# EAGLE design TUR8535 com mae - V1.02 (EAGLE 5.01)
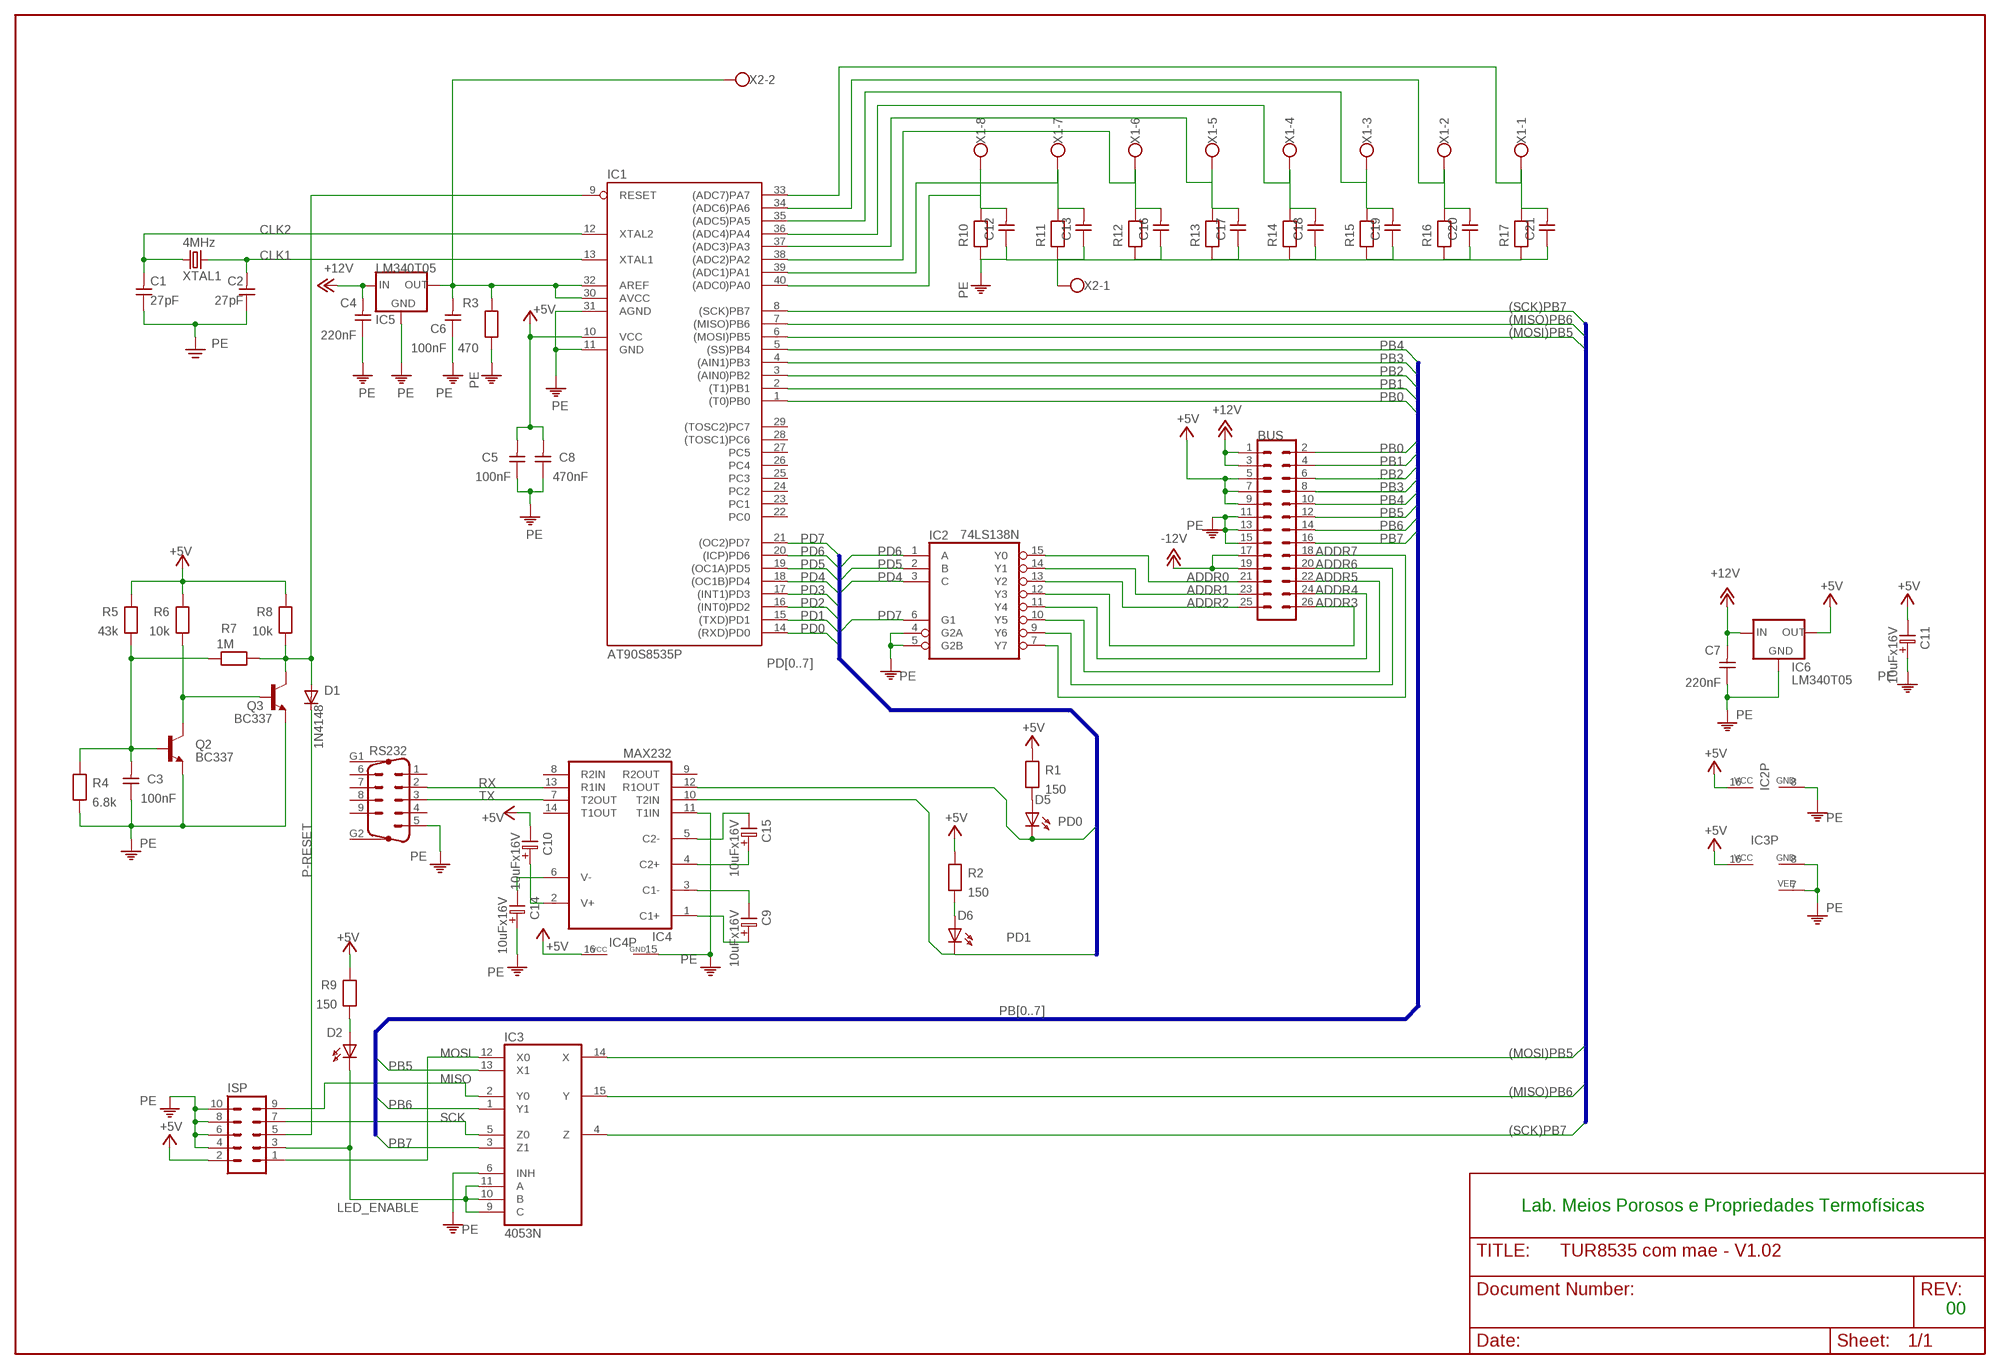
[diagram p0: schematic, sheet 1]

## Parts
BUS  ML26  [ML26]
C1  27pF  CAPNP-5  [C-5]
C2  27pF  CAPNP-5  [C-5]
C3  100nF  CAPNP-5  [C-5]
C4  220nF  CAPNP-5  [C-5]
C5  100nF  CAPNP-5  [C-5]
C6  100nF  CAPNP-5  [C-5]
C7  220nF  CAPNP-5  [C-5]
C8  470nF  CAPNP-5  [C-5]
C9  10uFx16V  ELC-2,5L  [ES-2,5L]
C10  10uFx16V  ELC-2,5L  [ES-2,5L]
C11  10uFx16V  ELC-2,5L  [ES-2,5L]
C12  CAPNP-5  [C-5]
C13  CAPNP-5  [C-5]
C14  10uFx16V  ELC-2,5L  [ES-2,5L]
C15  10uFx16V  ELC-2,5L  [ES-2,5L]
C16  CAPNP-5  [C-5]
C17  CAPNP-5  [C-5]
C18  CAPNP-5  [C-5]
C19  CAPNP-5  [C-5]
C20  CAPNP-5  [C-5]
C21  CAPNP-5  [C-5]
D1  1N4148  [DO35-10]
D2  LED5MM  [LED5MM]
D5  LED3MM  [LED3MM]
D6  LED3MM  [LED3MM]
IC1  AT90S8535P  [DIL40]
IC2  74LS138N  [DIL16]
IC3  4053N  [DIL16]
IC4  MAX232  [DIL16]
IC5  LM340T05  78XXL  [78XXL]
IC6  LM340T05  78XXL  [78XXL]
ISP  ML10  [ML10]
Q2  BC337  [TO92]
Q3  BC337  [TO92]
R1  150  RESEU-10  [R-10]
R2  150  RESEU-10  [R-10]
R3  470  RESEU-10  [R-10]
R4  6.8k  RESEU-10  [R-10]
R5  43k  RESEU-10  [R-10]
R6  10k  RESEU-10  [R-10]
R7  1M  RESEU-10  [R-10]
R8  10k  RESEU-10  [R-10]
R9  150  RESEU-10  [R-10]
R10  RESEU-10  [R-10]
R11  RESEU-10  [R-10]
R12  RESEU-10  [R-10]
R13  RESEU-10  [R-10]
R14  RESEU-10  [R-10]
R15  RESEU-10  [R-10]
R16  RESEU-10  [R-10]
R17  RESEU-10  [R-10]
RS232  M09HP  [M09HP]
X1  AK500/8  [AK500/8]
X2  AK500/2  [AK500/2]
XTAL1  4MHz  CRYTALHC18U-V  [HC18U-V]

## Nets
(MISO)PB6: IC1.7((MISO)PB6) IC3.15(Y)
(MOSI)PB5: IC1.6((MOSI)PB5) IC3.14(X)
(SCK)PB7: IC1.8((SCK)PB7) IC3.4(Z)
+5V: BUS.5 BUS.7 BUS.9 C5.2 C8.2 C10.2 C11.2 IC1.10(VCC) IC2.16(VCC) IC3.16(VCC) IC4.16(VCC) IC6.OUT ISP.2 R1.2 R2.2 R5.2 R6.2 R8.2 R9.2
+12V: BUS.1 BUS.3 C4.2 C7.2 IC5.IN IC6.IN
-12V: BUS.17 BUS.19
ADDR0: BUS.21 IC2.15(Y0)
ADDR1: BUS.23 IC2.14(Y1)
ADDR2: BUS.25 IC2.13(Y2)
ADDR3: BUS.26 IC2.12(Y3)
ADDR4: BUS.24 IC2.11(Y4)
ADDR5: BUS.22 IC2.10(Y5)
ADDR6: BUS.20 IC2.9(Y6)
ADDR7: BUS.18 IC2.7(Y7)
AREF: C6.2 IC1.30(AVCC) IC1.32(AREF) IC5.OUT R3.2 X2.2
CLK1: C2.2 IC1.13(XTAL1) XTAL1.2
CLK2: C1.2 IC1.12(XTAL2) XTAL1.1
LED_ENABLE: D2.K(C) IC3.9(C) IC3.10(B) IC3.11(A) ISP.3
MISO: IC3.2(Y0) ISP.9
MOSI: IC3.12(X0) ISP.1
N$2: C10.1 IC4.2(V+)
N$3: C14.2 IC4.6(V-)
N$7: Q2.3(C) Q3.2(B) R6.1
N$9: C3.2 Q2.2(B) R4.2 R5.1 R7.1
N$11: C15.2 IC4.5(C2-)
N$13: C15.1 IC4.4(C2+)
N$14: C9.2 IC4.3(C1-)
N$15: C9.1 IC4.1(C1+)
N$16: C12.2 IC1.40((ADC0)PA0) R10.2 X1.8
N$19: D2.A R9.1
N$20: D5.A R1.1
N$21: D6.A R2.1
N$22: C13.2 IC1.39((ADC1)PA1) R11.2 X1.7
N$23: C16.2 IC1.38((ADC2)PA2) R12.2 X1.6
N$24: C18.2 IC1.36((ADC4)PA4) R14.2 X1.4
N$25: C20.2 IC1.34((ADC6)PA6) R16.2 X1.2
N$26: C21.2 IC1.33((ADC7)PA7) R17.2 X1.1
N$29: C17.2 IC1.37((ADC3)PA3) R13.2 X1.5
N$31: C19.2 IC1.35((ADC5)PA5) R15.2 X1.3
P-RESET: D1.C ISP.5
PB0: BUS.2 IC1.1((T0)PB0)
PB1: BUS.4 IC1.2((T1)PB1)
PB2: BUS.6 IC1.3((AIN0)PB2)
PB3: BUS.8 IC1.4((AIN1)PB3)
PB4: BUS.10 IC1.5((SS)PB4)
PB5: BUS.12 IC3.13(X1)
PB6: BUS.14 IC3.1(Y1)
PB7: BUS.16 IC3.3(Z1)
PD0: D5.K(C) IC1.14((RXD)PD0) IC4.12(R1OUT)
PD1: D6.K(C) IC1.15((TXD)PD1) IC4.10(T2IN)
PD2: IC1.16((INT0)PD2)
PD3: IC1.17((INT1)PD3)
PD4: IC1.18((OC1B)PD4) IC2.3(C)
PD5: IC1.19((OC1A)PD5) IC2.2(B)
PD6: IC1.20((ICP)PD6) IC2.1(A)
PD7: IC1.21((OC2)PD7) IC2.6(G1)
PE: BUS.11 BUS.13 BUS.15 C1.1 C2.1 C3.1 C4.1 C5.1 C6.1 C7.1 C8.1 C11.1 C12.1 C13.1 C14.1 C16.1 C17.1 C18.1 C19.1 C20.1 C21.1 IC1.11(GND) IC1.31(AGND) IC2.4(G2A) IC2.5(G2B) IC2.8(GND) IC3.6(INH) IC3.7(VEE) IC3.8(GND) IC4.11(T1IN) IC4.15(GND) IC5.GND IC6.GND ISP.4 ISP.6 ISP.8 ISP.10 Q2.1(E) Q3.1(E) R3.1 R4.1 R10.1 R11.1 R12.1 R13.1 R14.1 R15.1 R16.1 R17.1 RS232.5 X2.1
RST: D1.A IC1.9(RESET) Q3.3(C) R7.2 R8.1
RX: IC4.13(R1IN) RS232.2
SCK: IC3.5(Z0) ISP.7
TX: IC4.7(T2OUT) RS232.3
Unconnected: IC1.22(PC0) IC1.23(PC1) IC1.24(PC2) IC1.25(PC3) IC1.26(PC4) IC1.27(PC5) IC1.28((TOSC1)PC6) IC1.29((TOSC2)PC7) IC4.8(R2IN) IC4.9(R2OUT) IC4.14(T1OUT) RS232.1 RS232.4 RS232.6 RS232.7 RS232.8 RS232.9 RS232.G1 RS232.G2

## Buses
PB[0..7]
(SCK)PB7,(MISO)PB6,(MOSI)PB5
PD[0..7]

## Notes on the sheet
- Lab. Meios Porosos e Propriedades Termofísicas
- 00

## Library data of the parts
BUS = con-harting-ml:ML26: HARTING
C1-C8 C12 C13 C16-C21 = discrete:CAPNP-5
C9-C11 C14 C15 = discrete:ELC-2,5L
D1 = diode:1N4148: DIODE high speed (Philips)
D2 D5 D6 = led:LED: LED
IC1 = atmel:AT90*8535P: MICROCONTROLLER 8 Kbytes FLASH 512 bytes SRAM 512 bytes EEPROM UART 8-channel 10 bit ADC
IC2 = 74xx-eu:74*138: 3-line to 8-line DECODER/DEMULTIPLEXER
IC3 = 40xx:4053: Triple 2-channel ANALOG MULTIPLEXER
IC4 = maxim:MAX232: RS232 TRANSEIVER
IC5 IC6 = v-reg:78XXL: VOLTAGE REGULATOR
ISP = con-harting-ml:ML10: HARTING
Q2 Q3 = transistor-npn:BC337*: NPN Transistor
R1-R17 = discrete:RESEU-10
RS232 = con-subd:M09HP: SUB-D
X1 = con-ptr500:AK500/8: CONNECTOR
X2 = con-ptr500:AK500/2: CONNECTOR
XTAL1 = crystal:CRYTAL: CRYSTAL

## Board
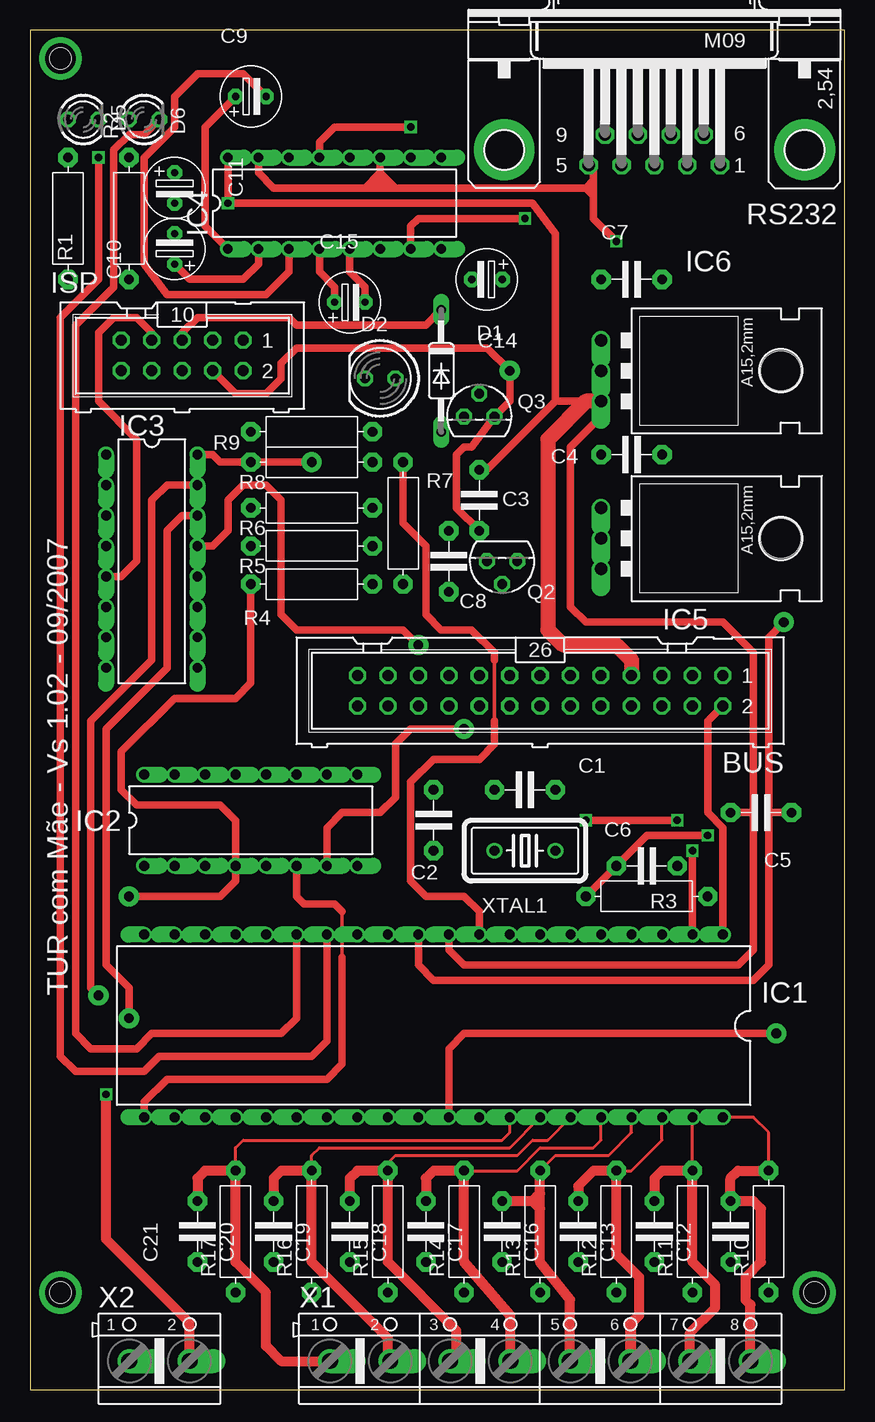
[diagram p1: board, top side]
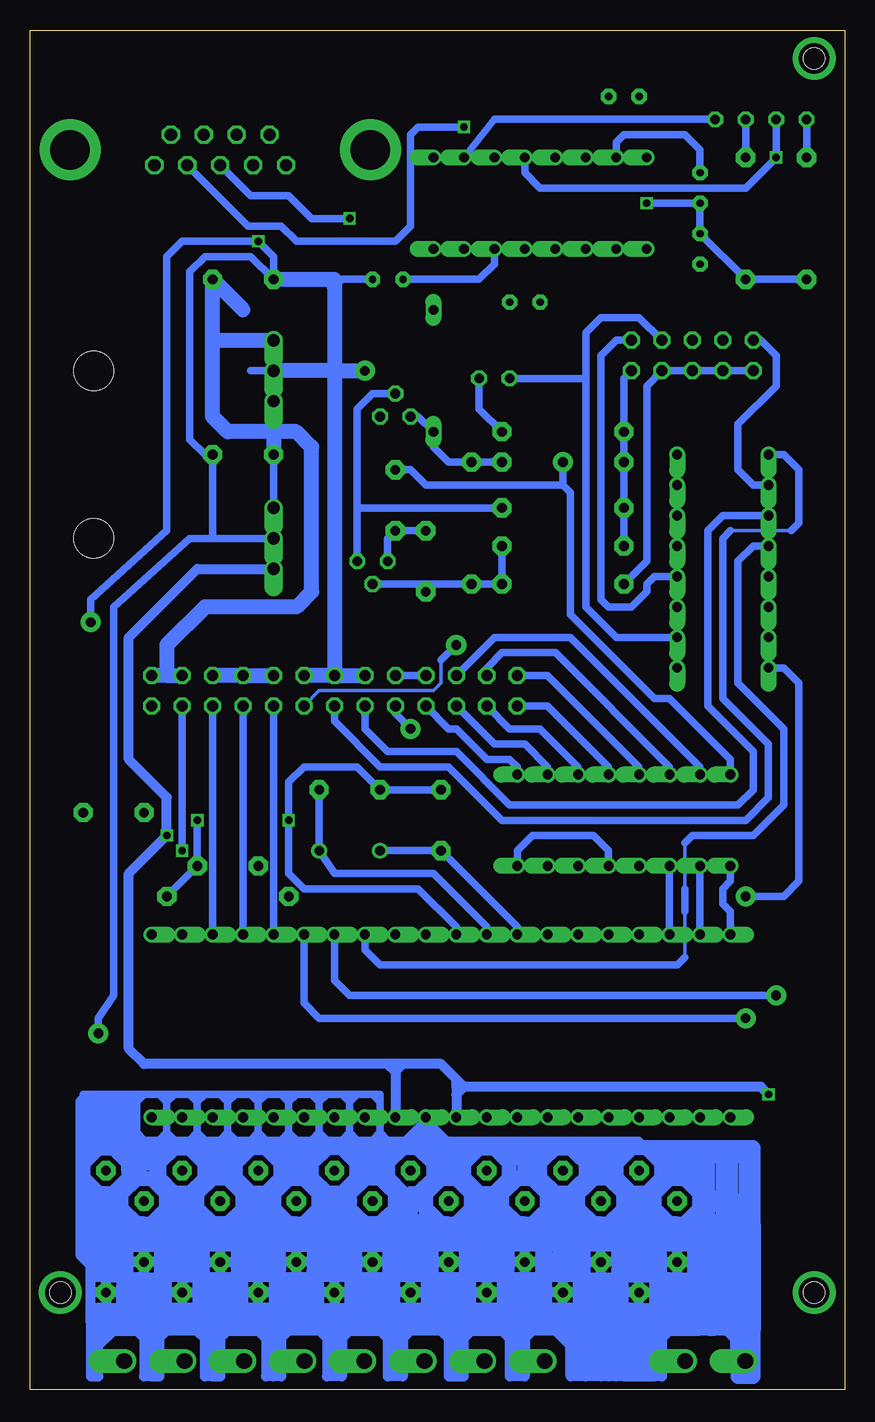
[diagram p2: board, bottom side, seen from below]

Size 67.92 x 113.34 mm. Coordinates in mm from the lower left corner, seen from the top.
Outline: 0,0 67.92,0 67.92,113.34 0,113.34 0,0
Copper layers used: Top, Bottom
Holes 1.78 mm at 2.53,110.96 2.53,8.09 65.4,8.09

### Footprints (pad centres in the part's own frame; a part is rotated, then mirrored left to right if it is on the bottom)
ML26 = drill 0.914 octagon: 1 -15.24,-1.27; 2 -15.24,1.27; 3 -12.7,-1.27; 4 -12.7,1.27; 5 -10.16,-1.27; 6 -10.16,1.27; 7 -7.62,-1.27; 8 -7.62,1.27; 9 -5.08,-1.27; 10 -5.08,1.27; 11 -2.54,-1.27; 12 -2.54,1.27; 13 0,-1.27; 14 0,1.27; 15 2.54,-1.27; 16 2.54,1.27; 17 5.08,-1.27; 18 5.08,1.27; 19 7.62,-1.27; 20 7.62,1.27; 21 10.16,-1.27; 22 10.16,1.27; 23 12.7,-1.27; 24 12.7,1.27; 25 15.24,-1.27; 26 15.24,1.27
C-5 = drill 0.813 pad 1.6 octagon: 1 -2.54,0; 2 2.54,0
ES-2,5L = drill 0.61 pad 1.27 octagon: 1 0,0; 2 2.54,0
DO35-10 = drill 0.813 long: A 5.08,0; C -5.08,0
LED5MM = drill 0.813 octagon: A -1.27,0; K 1.27,0
LED3MM = drill 0.813 octagon: A -1.27,0; K 1.27,0
DIL40 = drill 0.813 offset: 1 -24.13,-7.62; 2 -21.59,-7.62; 3 -19.05,-7.62; 4 -16.51,-7.62; 5 -13.97,-7.62; 6 -11.43,-7.62; 7 -8.89,-7.62; 8 -6.35,-7.62; 9 -3.81,-7.62; 10 -1.27,-7.62; 11 1.27,-7.62; 12 3.81,-7.62; 13 6.35,-7.62; 14 8.89,-7.62; 15 11.43,-7.62; 16 13.97,-7.62; 17 16.51,-7.62; 18 19.05,-7.62; 19 21.59,-7.62; 20 24.13,-7.62; 21 24.13,7.62; 22 21.59,7.62; 23 19.05,7.62; 24 16.51,7.62; 25 13.97,7.62; 26 11.43,7.62; 27 8.89,7.62; 28 6.35,7.62; 29 3.81,7.62; 30 1.27,7.62; 31 -1.27,7.62; 32 -3.81,7.62; 33 -6.35,7.62; 34 -8.89,7.62; 35 -11.43,7.62; 36 -13.97,7.62; 37 -16.51,7.62; 38 -19.05,7.62; 39 -21.59,7.62; 40 -24.13,7.62
DIL16 = drill 0.813 offset: 1 -8.89,-3.81; 2 -6.35,-3.81; 3 -3.81,-3.81; 4 -1.27,-3.81; 5 1.27,-3.81; 6 3.81,-3.81; 7 6.35,-3.81; 8 8.89,-3.81; 9 8.89,3.81; 10 6.35,3.81; 11 3.81,3.81; 12 1.27,3.81; 13 -1.27,3.81; 14 -3.81,3.81; 15 -6.35,3.81; 16 -8.89,3.81
78XXL = drill 1.016 offset: GND 0,-3.81; IN -2.54,-3.81; OUT 2.54,-3.81 | hole 3.302: 0,11.176
ML10 = drill 0.914 octagon: 1 -5.08,-1.27; 2 -5.08,1.27; 3 -2.54,-1.27; 4 -2.54,1.27; 5 0,-1.27; 6 0,1.27; 7 2.54,-1.27; 8 2.54,1.27; 9 5.08,-1.27; 10 5.08,1.27
TO92 = drill 0.813 octagon: 1 1.27,0; 2 0,1.905; 3 -1.27,0
R-10 = drill 0.813 pad 1.6 octagon: 1 -5.08,0; 2 5.08,0
M09HP = drill 1.016 octagon: 1 -5.486,1.27; 2 -2.743,1.27; 3 0,1.27; 4 2.743,1.27; 5 5.486,1.27; 6 -4.115,-1.27; 7 -1.372,-1.27; 8 1.372,-1.27; 9 4.115,-1.27 | drill 3.302 pad 5.08 round: G1 -12.522,0; G2 12.522,0
AK500/8 = drill 1.321 offset: 1 -17.526,0; 2 -12.497,0; 3 -7.518,0; 4 -2.489,0; 5 2.489,0; 6 7.518,0; 7 12.497,0; 8 17.526,0
AK500/2 = drill 1.321 offset: 1 -2.515,0; 2 2.515,0
HC18U-V = drill 0.813 round: 1 -2.54,0; 2 2.54,0

### Placement (x,y rotation side)
BUS  42.54,58.26 180 top
C1  41.27,50 0 top
C2  33.65,47.46 270 top
C3  34.92,69.05 270 top
C4  50.16,77.94 180 top
C5  60.95,48.09 180 top
C6  51.43,43.65 180 top
C7  50.16,92.55 0 top
C8  37.46,74.13 90 top
C9  17.14,107.78 0 top
C10  12.06,93.81 90 top
C11  12.06,101.44 270 top
C12  58.41,13.17 90 top
C13  52.06,13.17 90 top
C14  39.37,92.55 180 top
C15  25.39,90.64 0 top
C16  45.71,13.17 90 top
C17  39.37,13.17 90 top
C18  33.02,13.17 90 top
C19  26.66,13.17 90 top
C20  20.31,13.17 90 top
C21  13.96,13.17 90 top
D1  34.28,84.92 270 top
D2  29.2,84.29 180 top
D5  4.44,105.88 0 top
D6  9.52,105.88 0 top
IC1  33.65,30.31 180 top
IC2  18.41,47.46 0 top
IC3  10.15,69.05 270 top
IC4  25.39,98.89 0 top
IC5  51.43,70.95 270 top
IC6  51.43,84.92 270 top
ISP  12.7,86.2 180 top
Q2  39.37,69.05 180 top
Q3  37.46,81.11 0 top
R1  3.17,97.62 270 top
R2  8.25,97.62 270 top
R3  51.43,41.11 180 top
R4  23.49,67.14 0 top
R5  23.49,70.32 180 top
R6  23.49,73.5 180 top
R7  31.11,72.22 90 top
R8  23.49,77.31 180 top
R9  23.49,79.84 180 top
R10  61.59,13.17 90 top
R11  55.24,13.17 90 top
R12  48.89,13.17 90 top
R13  42.54,13.17 90 top
R14  36.19,13.17 90 top
R15  29.84,13.17 90 top
R16  23.49,13.17 90 top
R17  17.14,13.17 90 top
RS232  52.06,103.34 180 top
X1  42.54,2.38 0 top
X2  10.79,2.38 0 top
XTAL1  41.27,44.92 180 top

### Tracks (layer width: path | path; a pad name or v marks a point on that pad's centre or on a via)
(MISO)PB6  (via drill 0.81 pad 1.68)
  Top 0.61: v5.71,32.85 5.08,33.49 5.08,55.72 10.15,60.8 10.15,74.13 11.42,75.4 IC3.15
  Bottom 0.61: IC1.7 42.54,34.12 41.27,32.85 v5.71,32.85
(MOSI)PB5  (via drill 0.81 pad 1.68)
  Top 0.61: v8.25,30.95 8.25,33.49 6.35,35.4 6.35,55.08 11.42,60.16 11.42,71.59 12.7,72.86 IC3.14
  Bottom 0.61: IC1.6 45.08,32.22 43.81,30.95 v8.25,30.95
(SCK)PB7
  Bottom 0.305: 13.33,41.74 13.33,45.55 | 13.33,36.03 13.33,39.84
  Bottom 0.61: IC1.8 40,36.66 38.73,35.4 13.96,35.4 13.33,36.03 | 13.33,45.55 12.7,46.19 7.62,46.19 5.08,48.73 5.08,55.08 8.88,58.89 8.88,69.05 7.62,70.32 IC3.4 | 13.33,39.84 13.33,41.74
+5V  (via drill 0.61, 0.81 pad 1.68)
  Top 0.61: IC3.16 15.23,77.94 15.87,77.31 R8.2 v23.49,77.31 | IC1.10 34.92,36.66 36.19,35.4 59.05,35.4 60.32,36.66 60.32,48.09 | 60.32,48.09 60.32,61.43 57.78,63.97 46.35,63.97 45.08,65.24 45.08,78.58 47.62,81.11 IC6.OUT 43.81,82.39 | C8.2 38.09,76.67 43.81,82.39 | 60.32,48.09 C5.2 | 43.81,82.39 43.81,96.36 41.91,98.89 v16.5,98.89 IC4.16
  Top 1.27: IC6.OUT 46.35,82.39 43.17,79.21 43.17,63.34 44.45,62.07 48.89,62.07 50.16,60.8 BUS.7
  Bottom 0.61: R5.2 R6.2 R8.2 R9.2 18.41,84.29 ISP.2 | IC2.16 9.52,52.54 14.6,57.62 15.87,57.62 22.86,64.61 22.86,74.77 23.49,75.4 | 23.49,75.4 34.92,75.4 36.19,76.67 C8.2 | 23.49,75.4 v23.49,77.31 | R1.2 R2.2 C10.2 C11.2 v16.5,98.89
  Bottom 1.27: BUS.9 BUS.7 BUS.5
+12V
  Bottom 0.61: C4.2 IC5.IN
  Bottom 1.27: 56.51,59.52 BUS.3 | 56.51,59.52 BUS.1 | 52.7,87.47 52.7,81.11 51.43,79.84 47.62,79.84 | 52.7,87.47 C7.2 50.16,90 | 47.62,79.84 C4.2 | 52.7,87.47 IC6.IN | 56.51,59.52 56.51,62.07 53.34,65.24 45.71,65.24 44.45,66.51 44.45,78.58 45.71,79.84 47.62,79.84
-12V
  Bottom 0.61: BUS.19 BUS.17
ADDR0
  Bottom 0.61: IC2.15 12.06,51.91 22.86,62.7 29.2,62.7 BUS.21
ADDR1
  Bottom 0.61: IC2.14 14.6,51.91 24.12,61.43 28.57,61.43 29.84,60.16 BUS.23
ADDR2
  Bottom 0.61: IC2.13 17.14,51.91 24.76,59.52 BUS.25
ADDR3
  Bottom 0.61: IC2.12 19.68,51.91 24.76,56.98 BUS.26
ADDR4
  Bottom 0.61: IC2.11 22.22,51.91 25.39,55.08 27.93,55.08 BUS.24
ADDR5
  Bottom 0.61: IC2.10 24.76,51.91 26.66,53.81 29.2,53.81 BUS.22
ADDR6
  Bottom 0.61: IC2.9 27.3,51.91 27.93,52.54 29.84,52.54 32.38,55.08 33.02,55.08 BUS.20
ADDR7  (via drill 0.81 pad 1.68)
  Top 0.61: IC2.7 24.76,46.83 26.03,48.09 29.2,48.09 30.47,49.37 30.47,53.81 31.74,55.08 v36.19,55.08
  Bottom 0.61: v36.19,55.08 37.46,56.35 BUS.18
AREF  (via drill 0.61)
  Top 0.61: R3.2 C6.2 51.43,46.19 v56.51,46.19
  Top 0.813: X2.2 13.3,5.58 6.35,12.54 v6.35,24.6
  Bottom 0.61: 37.46,27.14 38.09,27.14
  Bottom 0.813: v6.35,24.6 6.98,25.23 31.74,25.23 | 31.74,25.23 32.38,25.23 | 32.38,25.87 33.65,27.14 36.83,27.14 | 36.83,27.14 37.46,27.14 37.46,26.51 | 36.83,27.14 37.46,26.51 | 36.83,27.14 38.09,27.14 | 37.46,26.51 38.09,27.14 | 37.46,26.51 IC1.32 | 32.38,24.6 IC1.30 | 32.38,25.23 32.38,24.6 | 32.38,25.23 32.38,25.87 | 31.74,25.23 32.38,25.87 | 31.74,25.23 32.38,24.6 | 38.09,27.14 58.41,27.14 59.69,28.41 59.69,43.02 v56.51,46.19 56.51,49.37 59.69,52.54 59.69,62.7 53.97,68.41 IC5.OUT
CLK1
  Bottom 0.61: XTAL1.2 C2.2 27.3,38.57 IC1.13
CLK2
  Bottom 0.61: C1.2 XTAL1.1 42.54,43.02 34.28,43.02 29.84,38.57 IC1.12
LED_ENABLE
  Bottom 0.61: IC3.9 IC3.10 | IC3.10 IC3.11 | IC3.10 19.04,62.7 21.59,65.24 21.59,84.29 | 21.59,84.29 21.59,88.1 20.31,89.37 17.14,89.37 ISP.3 | 21.59,84.29 D2.K
MISO
  Bottom 0.61: IC3.2 7.62,75.4 8.88,76.67 8.88,80.48 5.71,83.66 5.71,86.2 6.98,87.47 ISP.9
MOSI
  Bottom 0.61: ISP.1 19.04,87.47 20.31,86.2 20.31,65.88 19.68,65.24 17.77,65.24 16.5,66.51 16.5,67.14 15.87,67.78 IC3.12
N$1  (via drill 2.54)
  other vias: 2.53,110.96
N$2
  Top 0.61: IC4.2 19.04,93.81 17.77,92.55 13.33,92.55 C10.1
N$3
  Bottom 0.61: IC4.6 29.2,93.81 30.47,92.55 C14.2
N$4  (via drill 2.54)
  other vias: 2.53,8.09
N$5  (via drill 2.54)
  other vias: 65.4,8.09
N$7
  Bottom 0.61: 40.63,73.5 Q2.3 | R6.1 40.63,73.5 | Q3.2 39.37,83.02 40.63,81.75 40.63,73.5
N$8
  Bottom 1.27: 26.66,19.52 25.39,19.52 | 26.66,19.52 27.93,19.52 | 26.66,18.25 26.66,19.52
N$9
  Bottom 0.61: 34.92,67.14 R7.1 R4.2 R5.1 | 34.92,67.14 C3.2 | 34.92,67.14 Q2.2
N$11
  Top 0.61: C15.2 27.93,91.91 26.66,93.18 IC4.5
N$12
  Top 0.813: 50.8,9.36 50.8,6.18 50.16,5.55 50.16,2.38
N$13
  Top 0.61: C15.1 25.39,91.91 24.12,93.18 IC4.4
N$14
  Top 0.61: IC4.3 21.59,93.18 19.68,91.28 11.42,91.28 9.52,93.81 9.52,102.7 12.06,105.25 12.06,107.78 13.96,109.69 17.77,109.69 C9.2
N$15
  Top 0.61: IC4.1 14.6,96.99 14.6,105.25 C9.1
N$16
  Top 0.254: IC1.40 60.32,22.7 61.59,21.43 R10.2
  Top 0.813: R10.2 59.05,18.25 58.41,17.62 C12.2 60.32,15.71 60.95,15.07 60.95,10.63 59.69,9.36 59.69,7.46 60.07,7.07 X1.8
N$19
  Bottom 0.61: R9.1 30.47,81.75 D2.A
N$20
  Bottom 0.61: R1.1 D5.A
N$21
  Bottom 0.61: R2.1 D6.A
N$22
  Top 0.254: R11.2 IC1.39
  Top 0.813: C13.2 52.06,17.62 52.7,18.25 R11.2 55.24,10.63 57.14,8.72 57.14,6.82 55.04,4.71 X1.7
N$23
  Top 0.254: R12.2 50.16,18.25 52.7,20.79 IC1.38
  Top 0.813: C16.2 45.71,16.98 46.98,18.25 R12.2 48.89,11.27 50.8,9.36 50.8,6.18 50.06,5.45 X1.6
N$24
  Top 0.254: R14.2 40.63,18.25 42.54,20.16 46.98,20.16 47.62,20.79 IC1.36
  Top 0.813: C18.2 33.02,17.62 33.65,18.25 R14.2 36.19,10.63 40.05,6.13 X1.4
N$25
  Top 0.254: R16.2 23.49,19.52 24.12,20.16 40,20.16 IC1.34
  Top 0.813: C20.2 20.31,17.62 20.95,18.25 R16.2 23.49,10.63 29.84,4.28 29.84,2.38 X1.2
N$26
  Top 0.254: R17.2 17.14,20.16 17.77,20.79 39.37,20.79 40,21.43 IC1.33
  Top 0.813: C21.2 13.96,17.62 14.6,18.25 R17.2 17.14,10.63 19.68,8.09 19.68,3.64 20.95,2.38 X1.1
N$27
  Bottom 1.27: 16.5,15.07 17.14,14.44
N$28
  Bottom 1.27: 32.38,18.25 32.38,19.52 33.65,19.52 33.65,18.88 33.02,18.25
N$29
  Top 0.254: R13.2 43.81,19.52 48.26,19.52 50.16,21.43 IC1.37
  Top 0.813: 41.91,15.71 C17.2 | 42.54,16.34 41.91,15.71 | X1.5 45.03,7.51 42.54,10.63 42.54,15.07 | 42.54,15.07 42.54,16.34 | 42.54,16.34 R13.2 | 42.54,15.07 41.91,15.71
N$30
  Bottom 1.27: 52.06,19.52 51.43,19.52
N$31
  Top 0.254: R15.2 29.84,18.88 30.47,19.52 40.63,19.52 41.91,20.79 43.17,20.79 IC1.35
  Top 0.813: C19.2 26.66,17.62 27.3,18.25 R15.2 29.84,10.63 35.55,4.91 35.55,2.38 X1.3
N$32
  Bottom 0.813: 39.37,11.27 39.37,13.17
N$33
  Bottom 0.813: 52.06,13.17 52.06,11.27
P-RESET
  Top 0.61: D1.C 33.02,88.73 22.22,88.73 21.59,89.37 13.96,89.37 12.7,88.1 ISP.5
PB0
  Top 0.61: IC1.1 57.78,46.83 56.51,48.09 56.51,55.72 BUS.2
PB1  (via drill 0.61)
  Top 0.61: IC1.2 v55.24,44.92
  Bottom 0.61: v55.24,44.92 BUS.4
PB2
  Bottom 0.61: IC1.3 BUS.6
PB3
  Bottom 0.61: IC1.4 BUS.8
PB4
  Bottom 0.61: IC1.5 BUS.10
PB5  (via drill 0.81 pad 1.68)
  Top 0.61: v32.38,62.07 31.11,63.34 22.22,63.34 20.95,64.61 20.95,74.13 19.68,75.4 17.77,75.4 16.5,74.13 16.5,71.59 15.23,70.32 IC3.13
  Bottom 0.305: BUS.12 43.81,58.26 34.28,58.26 33.65,58.89 33.65,60.8
  Bottom 0.61: v32.38,62.07 33.65,60.8
PB6
  Bottom 0.305: 9.52,71.59 4.44,71.59
  Bottom 0.61: BUS.14 42.54,55.72 38.73,51.91 33.02,51.91 28.57,47.46 8.25,47.46 6.35,49.37 6.35,53.81 10.15,57.62 10.15,70.95 9.52,71.59 | IC3.1 5.08,77.94 3.81,76.67 3.81,72.22 4.44,71.59
PB7
  Bottom 0.61: BUS.16 40,55.08 38.09,53.18 32.38,53.18 27.93,48.73 8.88,48.73 7.62,50 7.62,53.18 11.42,56.98 11.42,71.59 10.15,72.86 IC3.3
PD0  (via drill 0.61)
  Top 0.61: IC1.14 24.76,29.05 23.49,27.77 10.79,27.77 9.52,26.51 3.81,26.51 2.53,27.77 2.53,89.37 5.71,92.55 v5.71,102.7
  Bottom 0.61: D5.K v5.71,102.7 8.25,100.17 25.39,100.17 26.66,101.44 IC4.12
PD1
  Top 0.61: IC1.15 22.22,30.95 20.95,29.68 10.15,29.68 8.88,28.41 5.08,28.41 3.81,29.68 3.81,88.73 6.98,91.91 6.98,103.34 8.25,104.61 9.52,104.61 D6.K
  Bottom 0.61: D6.K 29.2,105.88 IC4.10
PD4
  Bottom 0.61: IC1.18 IC2.3
PD5
  Bottom 0.61: IC1.19 IC2.2
PD6
  Bottom 0.61: IC1.20 9.52,39.84 10.15,40.48 10.15,41.74 9.52,42.38 IC2.1
PD7
  Top 0.305: 26.03,36.03 26.03,39.84
  Top 0.61: IC1.21 9.52,23.96 11.42,25.87 24.76,25.87 26.03,27.14 26.03,36.03 | 26.03,39.84 25.39,40.48 22.86,40.48 22.22,41.11 IC2.6
PE  (via drill 0.61, 0.81 pad 1.68)
  Top 0.61: C8.1 35.55,73.5 35.55,77.94 36.19,78.58 36.83,78.58 Q3.1 40,82.39 v40,84.92 38.09,86.83 22.22,86.83 20.95,85.56 20.95,84.29 19.68,83.02 17.14,83.02 ISP.4 | IC1.11 32.38,35.4 33.65,34.12 60.32,34.12 61.59,35.4 61.59,48.09 | 61.59,48.09 61.59,62.7 v62.86,63.97 | R4.1 18.41,58.89 17.14,57.62 12.06,57.62 7.62,53.18 7.62,50 8.88,48.73 15.87,48.73 17.14,47.46 IC2.4 17.14,42.38 15.87,41.11 v8.25,41.11 | v62.23,29.68 36.19,29.68 34.92,28.41 IC1.31 | 61.59,48.09 C5.1 | v46.35,47.46 v53.97,47.46 | IC4.15 19.04,101.44 20.31,100.17 27.93,100.17 | 29.2,101.44 27.93,100.17 | 29.2,101.44 IC4.11 | v48.89,95.72 46.98,97.62 46.98,99.53 | 46.98,99.53 46.98,100.17 | 46.98,100.17 46.98,100.8 | 46.98,100.17 46.35,100.17 | 46.35,100.17 30.47,100.17 | 46.35,100.17 46.98,100.8 | 46.98,99.53 46.35,100.17 | 30.47,100.17 29.2,101.44 | 30.47,100.17 29.84,100.17 | 29.84,100.17 27.93,100.17 | 27.93,100.17 29.2,100.8 29.84,100.17 | RS232.5 46.98,102.07 46.98,100.8
  Bottom 0.61: C2.1 C1.1 40.63,51.91 45.08,51.91 46.35,50.64 v46.35,47.46 46.35,43.02 45.08,41.74 35.55,41.74 32.38,38.57 IC1.11 | IC2.8 27.3,44.92 26.03,46.19 20.95,46.19 19.68,44.92 IC2.5 IC2.4 | IC3.6 IC3.7 IC3.8 5.08,60.16 3.81,58.89 3.81,42.38 5.08,41.11 v8.25,41.11 | R4.1 16.5,69.05 16.5,83.66 ISP.4 ISP.6 ISP.8 ISP.10 | 52.7,70.95 54.6,70.95 60.95,65.24 60.95,32.85 62.23,30.95 v62.23,29.68 | 52.7,70.95 IC5.GND | IC6.GND 49.52,84.92 | 52.7,70.95 C4.1 53.34,77.94 54.6,79.21 54.6,93.18 53.34,94.45 49.52,94.45 C7.1 47.62,94.45 v48.89,95.72 55.24,95.72 56.51,94.45 56.51,71.59 62.86,65.88 v62.86,63.97 | C3.1 C8.1 38.09,70.95 Q2.1 | R3.1 C6.1 v53.97,47.46 | IC4.15 19.04,103.98 18.41,104.61 13.33,104.61 12.06,103.34 C11.1 | 42.54,92.55 41.91,92.55 | 42.54,91.91 41.91,92.55 | 41.91,92.55 C14.1 | 61.59,21.43 60.95,21.43 59.69,21.43 | 41.27,21.43 41.27,22.7 | 41.27,20.16 41.27,21.43 | 41.27,23.96 41.27,24.6 40.63,24.6 | 39.37,24.6 38.73,24.6 38.73,23.96 | 38.73,21.43 38.73,23.96 | 38.73,20.16 38.73,20.79 | 38.73,20.79 38.73,21.43 | 38.73,21.43 39.37,20.79 40.63,20.79 41.27,21.43 | 41.27,21.43 41.27,23.96 | 40.63,24.6 41.27,23.96 | 39.37,24.6 40.63,24.6 | 38.73,23.96 39.37,24.6 | 39.37,24.6 43.17,24.6 | 43.17,24.6 43.81,24.6 | 43.81,24.6 45.71,24.6 | 45.71,24.6 46.35,24.6 | 46.35,24.6 48.26,24.6 | 48.26,24.6 48.89,24.6 | 48.89,24.6 50.8,24.6 | 50.8,24.6 51.43,24.6 | 53.34,24.6 51.43,24.6 | 53.97,24.6 53.34,24.6 | 55.88,24.6 53.97,24.6 | 56.51,24.6 55.88,24.6 | 58.41,24.6 56.51,24.6 | 59.05,20.79 59.05,21.43 | 59.05,20.16 59.05,20.79 | 41.91,20.79 41.27,20.79 40.63,20.16 | 41.91,20.79 43.81,20.79 | 43.81,20.79 44.45,20.79 | 44.45,20.79 46.35,20.79
  Bottom 0.61: 46.35,20.79 46.98,20.79 | 46.98,20.79 48.26,20.79 | 48.26,20.79 48.89,20.79 | 48.89,20.79 49.52,20.79 | 49.52,20.79 50.8,20.79 | 52.06,20.79 50.8,20.79 | 53.34,20.79 52.06,20.79 | 54.6,20.79 53.34,20.79 | 55.88,20.79 54.6,20.79 | 57.14,20.79 55.88,20.79 | 58.41,20.79 57.14,20.79 | 59.05,20.79 58.41,20.79 | 43.81,21.43 43.81,22.7 | 43.81,20.79 43.81,21.43 | 43.81,23.96 43.81,21.43 | 43.81,24.6 43.81,23.96 | 46.35,20.79 46.35,21.43 | 46.35,23.96 46.35,21.43 | 46.35,24.6 46.35,23.96 | 48.89,24.6 48.89,23.96 | 48.89,23.96 48.89,21.43 | 48.89,21.43 48.89,20.79 | 51.43,24.6 51.43,23.96 | 51.43,23.96 51.43,21.43 | 51.43,21.43 50.8,20.79 | 52.06,20.79 51.43,21.43 | 53.97,24.6 53.97,23.96 | 53.97,23.96 53.97,21.43 | 53.34,20.79 53.97,21.43 | 54.6,20.79 53.97,21.43 | 56.51,24.6 56.51,23.96 | 56.51,23.96 56.51,21.43 | 55.88,20.79 56.51,21.43 | 57.14,20.79 56.51,21.43 | 59.05,21.43 58.41,20.79 | 59.05,21.43 59.05,23.96 58.41,24.6 | 58.41,24.6 57.14,24.6 56.51,23.96 | 56.51,23.96 55.88,24.6 | 55.88,24.6 54.6,24.6 53.97,23.96 | 53.97,23.96 53.34,24.6 | 53.34,24.6 52.06,24.6 51.43,23.96 | 50.8,24.6 51.43,23.96 | 50.8,24.6 49.52,24.6 48.89,23.96 | 48.26,24.6 48.89,23.96 | 48.26,24.6 46.98,24.6 46.35,23.96 | 45.71,24.6 46.35,23.96 | 45.71,24.6 44.45,24.6 43.81,23.96 | 43.17,24.6 43.81,23.96 | 43.17,24.6 41.91,24.6 41.27,23.96 | 41.27,21.43 41.91,20.79 | 41.91,20.79 43.17,20.79 43.81,21.43 | 43.81,21.43 44.45,20.79 | 44.45,20.79 45.71,20.79 46.35,21.43 | 46.35,21.43 46.98,20.79 | 48.26,20.79 48.89,21.43 | 48.89,21.43 49.52,20.79 | 59.05,24.6 58.41,24.6 | 59.05,24.6 63.5,24.6 63.5,23.96 | 59.05,24.6 62.23,24.6 62.86,23.96 62.86,21.43 | 62.86,21.43 62.86,20.79 62.23,20.79
  Bottom 0.61: 62.23,20.79 60.95,20.79 60.32,20.79 | 59.05,20.79 59.69,20.79 | 59.05,20.79 59.05,24.6 | 59.05,24.6 60.32,24.6 60.95,23.96 61.59,23.96 | 62.23,22.7 62.23,22.06 62.86,21.43 | 62.86,21.43 62.23,20.79 | 59.69,23.96 59.69,22.7 | 38.09,20.79 17.14,20.79 16.5,20.16 | 38.09,20.79 38.73,20.79 | 38.09,20.79 38.73,21.43 | 19.04,7.46 21.59,7.46 20.95,7.46 20.95,8.72 | 20.95,8.72 19.68,8.72 | 20.95,8.72 21.59,8.72 21.59,9.36 22.22,9.36 22.22,10.63 22.86,10.63 22.86,10 24.12,10 24.12,11.27 23.49,11.27 | 23.49,11.27 22.86,11.27 | 23.49,10.63 23.49,11.27 | 18.41,5.55 18.41,4.91 | 23.49,6.18 23.49,5.55 18.41,5.55 | 22.86,6.18 17.14,6.18 17.77,6.18 18.41,5.55 | 18.41,5.55 18.41,6.18 17.77,6.82 13.33,6.82 | 12.7,7.46 14.6,7.46 17.77,4.28 | 17.77,4.28 18.41,3.64 18.41,4.91 | 18.41,4.91 17.77,5.55 17.14,5.55 | 17.14,5.55 16.5,6.18 16.5,5.55 17.77,4.28 | 17.77,4.28 18.41,4.91 | 18.41,4.91 17.77,4.91 17.14,5.55 | 18.41,5.55 17.14,5.55
  Bottom 0.813: 13.96,9.36 C21.1 | 13.96,9.36 13.96,8.09 R17.1 | 19.04,8.09 20.31,8.09 C20.1 | R16.1 23.49,10.63 | R16.1 26.66,8.09 C19.1 | C19.1 29.84,10.63 R15.1 | R15.1 33.02,8.09 C18.1 | C18.1 36.19,10.63 R14.1 | R14.1 39.37,8.09 C17.1 42.54,10.63 R13.1 | R13.1 45.71,8.09 C16.1 | 47.62,10.63 48.89,10.63 R12.1 | R12.1 52.06,8.09 C13.1 55.24,10.63 55.24,9.36 | 55.24,9.36 R11.1 | R11.1 58.41,8.09 58.41,9.36 | 58.41,9.36 58.41,10 | 58.41,10 C12.1 61.59,10.63 | 11.42,8.09 7.62,4.28 7.62,3.01 8.25,2.38 X2.1 | 10.79,5.55 11.42,6.18 13.96,6.18 | 58.41,10 58.41,13.8 | 61.59,10.63 61.59,11.27 | 61.59,11.27 61.59,14.44 | 61.59,10.63 62.86,10.63 62.86,10 | 56.51,10.63 61.59,10.63 | 56.51,10.63 50.16,10.63 | 50.16,10.63 47.62,10.63 | 46.98,10.63 47.62,10.63 | C16.1 46.98,10.63 | C18.1 C16.1 | C19.1 C18.1 | 22.22,10.63 C20.1 | 22.22,10.63 23.49,10.63 | 23.49,10.63 C19.1 | 19.04,10.63 C20.1 | 17.14,10.63 19.04,10.63 | 17.14,10.63 15.23,10.63 | 15.23,10.63 12.7,10.63 | 12.06,10.63 11.42,10.63 | 13.96,9.36 13.96,13.8 | C20.1 20.31,13.8 | C19.1 26.66,13.8 | C18.1 33.02,13.8 | C16.1 45.71,13.8 | R11.1 R10.1 | R11.1 R12.1 | 46.98,8.09 R12.1 | R13.1 46.98,8.09 | R14.1 R13.1 | R16.1 R14.1 | R17.1 10.79,8.09 10.15,7.46 | 15.87,6.18 16.5,6.18 17.14,6.18 | 17.14,6.18 18.41,6.18 22.86,6.18 | 22.86,6.18 23.49,6.18 | 29.84,6.18 36.19,6.18 | 36.19,6.18 48.89,6.18 | 48.89,6.18 55.24,6.18 | 55.24,6.18 60.32,6.18 | 61.59,6.18 60.32,6.18 | 62.86,6.18 61.59,6.18 | 62.86,6.18 62.86,6.82 | 62.86,9.36 62.86,10 | 61.59,6.18 61.59,6.82 | R10.1 61.59,6.82 | R10.1 61.59,9.36 | 61.59,9.36 61.59,10.63 | 62.86,10 62.86,13.17 | 62.23,10 62.23,13.8 | R11.1 55.24,6.18 | 48.89,6.18 R12.1 | 48.89,6.18 42.54,6.18 R13.1 | R14.1 R13.1 | R14.1 R15.1
  Bottom 0.813: 29.84,6.18 R15.1 | 26.03,6.18 29.84,6.18 | 23.49,6.18 24.76,6.18 | 23.49,6.18 R16.1 | 19.04,8.09 R16.1 | R17.1 19.04,8.09 | 17.14,6.18 R17.1 | R17.1 17.14,10.63 | R14.1 36.19,6.18 | 58.41,9.36 59.69,9.36 | 59.69,9.36 59.69,11.9 57.14,11.9 57.14,9.36 58.41,9.36 | 61.59,9.36 59.69,9.36 | 59.69,9.36 60.32,9.36 60.32,8.72 | 60.32,7.46 60.32,8.72 | 60.32,7.46 60.32,6.82 61.59,6.82 | 60.32,8.72 57.14,8.72 57.14,7.46 | 57.14,7.46 57.14,6.82 56.51,6.82 | 56.51,9.36 56.51,6.82 | 56.51,9.36 56.51,10.63 | 55.24,9.36 56.51,9.36 | 55.24,9.36 53.97,9.36 53.97,6.82 56.51,6.82 | 60.32,7.46 57.14,7.46 | 60.32,6.18 60.32,7.46 | 60.32,6.18 57.78,6.18 57.78,6.82 59.69,6.82 | 60.32,11.9 60.32,10 | 60.32,11.9 61.59,11.9 61.59,11.27 | 61.59,11.27 60.95,11.27 | 60.95,11.27 60.95,10 | 60.95,11.27 60.95,13.8 59.69,13.8 59.69,12.54 | 27.93,13.17 60.32,13.17 | 27.93,13.17 12.06,13.17 | 12.06,11.9 11.42,11.9 | 12.7,11.9 15.23,11.9 | 19.04,11.9 27.93,11.9 | 27.93,11.9 31.11,11.9 | 31.74,11.9 34.28,11.9 | 35.55,11.9 37.46,11.9 | 41.27,11.9 38.09,11.9 | 41.27,11.9 43.81,11.9 | 46.98,11.9 44.45,11.9 | 50.8,11.9 53.34,11.9 | 55.88,11.9 53.34,11.9 | 60.32,11.9 55.88,11.9 | 59.69,12.54 60.32,12.54 | 40.63,12.54 59.69,12.54 | 28.57,12.54 40.63,12.54 | 28.57,12.54 25.39,12.54 | 24.12,12.54 25.39,12.54 | 24.12,12.54 22.22,12.54 | 21.59,12.54 11.42,12.54 | 15.23,10.63 15.23,11.27 | 15.23,11.27 15.23,11.9 | 19.04,11.9 15.23,11.9 | 19.04,10.63 19.04,11.9 | 19.04,10.63 15.87,10.63 15.87,11.27 | 15.87,11.27 19.04,11.27 19.04,10 | 19.04,10 19.04,8.72 | 12.7,10.63 12.7,11.27 | 12.06,10.63 12.06,11.9 | 12.7,11.9 12.06,11.9 | 12.7,9.36 12.7,11.9 | 12.7,8.72 12.7,9.36 | 12.7,8.72 12.06,8.72 12.06,10.63 | 12.7,10.63 12.06,10.63
  Bottom 0.813: 12.7,10.63 12.7,9.36 | 14.6,9.36 12.7,9.36 | 14.6,9.36 15.23,9.36 15.23,11.27 | 15.23,11.27 15.23,8.72 12.7,8.72 | 12.7,8.72 15.87,8.72 15.87,10 | 15.87,10 15.87,11.27 | 15.87,7.46 15.87,10 | 15.87,6.82 15.87,7.46 | 15.87,6.82 15.87,6.18 | 13.96,6.18 12.06,6.18 12.06,6.82 | 13.96,6.18 15.23,6.18 | 15.23,6.18 15.87,6.18 | 12.06,6.82 12.06,7.46 12.7,7.46 15.87,7.46 | 15.87,7.46 15.23,7.46 15.23,6.82 | 13.33,6.82 12.06,6.82 | 15.87,6.82 17.77,6.82 18.41,6.82 | 18.41,6.82 19.04,6.82 | 19.04,6.82 21.59,6.82 | 21.59,6.82 22.22,6.82 | 22.22,6.82 27.93,6.82 | 46.98,6.82 47.62,6.82 | 47.62,6.82 50.16,6.82 | 50.8,6.82 50.16,6.82 | 53.34,6.82 50.8,6.82 | 61.59,6.82 62.23,6.82 | 61.59,6.82 53.34,6.82 | 50.16,10 50.16,6.82 | 50.16,10.63 50.16,10 | 47.62,10.63 47.62,6.82 | 46.98,10.63 46.98,10 | 21.59,9.36 14.6,9.36 | 21.59,9.36 55.24,9.36 | 15.87,10 18.41,10 18.41,6.82 | 19.04,8.09 19.04,10 | 19.04,8.09 19.04,7.46 19.04,6.82 | 21.59,6.82 21.59,7.46 21.59,9.36 | 21.59,9.36 21.59,12.54 | 21.59,12.54 22.22,12.54 | 22.22,10.63 22.22,12.54 | 22.22,6.82 22.22,10.63 | 24.12,12.54 24.76,12.54 24.76,6.18 | 24.76,6.18 26.03,6.18 | 26.03,6.18 25.39,6.18 25.39,8.72 | 25.39,12.54 25.39,8.72 | 25.39,12.54 27.93,12.54 27.93,11.9 | 27.93,11.9 27.93,11.27 | 27.93,6.82 28.57,6.82 | 28.57,6.82 31.74,6.82 | 31.74,6.82 34.28,6.82 | 34.28,6.82 34.92,6.82 | 34.92,6.82 37.46,6.82 | 37.46,6.82 41.27,6.82 | 43.81,6.82 44.45,6.82 | 27.93,6.82 27.93,7.46 | 27.93,7.46 27.93,8.72 | 27.93,8.72 27.93,10 | 27.93,11.27 27.93,13.17 | 27.93,13.17 28.57,13.17 28.57,12.54 | 28.57,6.82 28.57,12.54 | 28.57,6.82 31.11,6.82 31.11,10 | 31.11,10 31.11,11.27 | 31.11,11.9 31.11,11.27 | 31.11,11.9 31.74,11.9 | 31.74,8.72 31.74,11.9
  Bottom 0.813: 31.74,6.82 31.74,7.46 | 34.28,6.82 34.28,7.46 | 34.28,7.46 34.28,8.72 | 34.28,11.9 34.28,8.72 | 34.28,11.9 35.55,11.9 | 35.55,11.9 34.92,11.9 34.92,11.27 | 34.92,6.82 34.92,10 | 37.46,6.82 37.46,10 | 37.46,10 37.46,11.27 | 37.46,11.9 37.46,11.27 | 38.09,11.9 37.46,11.9 | 38.09,8.72 38.09,11.9 | 38.09,8.72 38.09,7.46 40.63,7.46 40.63,8.72 | 40.63,12.54 40.63,8.72 | 40.63,12.54 41.27,12.54 41.27,11.9 | 41.27,11.9 41.27,11.27 | 41.27,6.82 41.27,10 | 43.81,6.82 41.27,6.82 | 43.81,7.46 43.81,6.82 | 43.81,8.72 43.81,11.27 | 43.81,11.27 43.81,11.9 | 43.81,11.9 44.45,11.9 | 44.45,11.9 44.45,10 | 44.45,6.82 44.45,10 | 46.98,6.82 44.45,6.82 | 46.98,7.46 46.98,6.82 | 46.98,8.09 46.98,7.46 | 46.98,8.09 46.98,8.72 | 46.98,8.72 46.98,10 | 46.98,10 46.98,11.9 | 46.98,11.9 50.16,11.9 | 50.16,11.9 50.8,11.9 | 50.8,11.9 50.8,8.72 | 50.8,6.82 50.8,8.72 | 53.34,6.82 53.34,7.46 | 53.34,8.72 53.34,11.9 | 53.34,11.9 53.97,11.9 53.97,10 54.6,10 54.6,11.27 55.88,11.27 | 55.88,11.9 55.88,11.27 | 55.88,11.9 56.51,11.9 56.51,11.27 55.88,11.27 | 55.88,11.27 55.88,10 | 53.34,8.72 50.8,8.72 | 53.34,7.46 53.34,8.72 | 53.34,7.46 51.43,7.46 | 46.98,10 50.16,10 | 50.16,10 50.16,11.9 | 50.16,11.9 47.62,11.9 47.62,11.27 49.52,11.27 | 46.98,7.46 43.81,7.46 | 43.81,8.72 43.81,7.46 | 46.98,8.72 43.81,8.72 | 40.63,8.72 38.09,8.72 | 44.45,10 41.27,10 | 41.27,11.27 41.27,10 | 43.81,11.27 41.27,11.27 | 34.92,11.27 37.46,11.27 | 34.92,10 34.92,11.27 | 34.92,10 37.46,10 | 31.74,7.46 34.28,7.46 | 31.74,7.46 31.74,8.72 | 31.74,8.72 34.28,8.72 | 31.11,10 27.93,10 | 27.93,11.27 27.93,10 | 27.93,11.27 31.11,11.27 | 27.93,8.72 25.39,8.72 | 25.39,8.72 26.03,8.72 26.03,7.46 27.93,7.46 | 11.42,4.91 13.33,6.82 | 13.33,6.82 15.23,6.82
  Bottom 0.813: 15.23,6.82 18.41,3.64 18.41,1.11 | 18.41,1.11 19.04,1.11 | 22.86,6.18 23.49,5.55 | 22.86,6.18 19.68,6.18 18.41,4.91 | 18.41,4.91 18.41,1.74 19.04,1.11 | 19.04,3.01 19.04,4.91 18.41,5.55 34.28,5.55 | 34.28,5.55 44.45,5.55 | 44.45,5.55 52.7,5.55 | 52.7,5.55 62.86,5.55 | 62.86,5.55 62.86,6.18 | 62.23,4.91 62.86,4.91 | 62.23,4.91 61.59,4.91 | 61.59,4.91 60.95,4.91 | 59.05,4.91 58.41,4.91 | 53.97,4.91 56.51,4.91 | 56.51,4.91 57.14,4.91 | 52.06,4.91 51.43,4.91 | 48.26,4.91 48.89,4.91 | 43.17,4.91 47.62,4.91 | 41.91,4.91 39.37,4.91 | 38.73,4.91 39.37,4.91 | 38.09,4.91 38.73,4.91 | 35.55,4.91 37.46,4.91 | 32.38,4.91 29.2,4.91 | 29.2,4.91 28.57,4.91 | 27.93,4.91 28.57,4.91 | 25.39,4.91 26.66,4.91 | 18.41,4.91 24.12,4.91 | 24.12,4.91 25.39,4.91 | 26.66,4.91 27.3,4.91 | 27.3,4.91 27.93,4.91 | 26.66,4.28 26.66,1.11 27.93,1.11 27.93,4.91 | 27.3,4.91 26.66,4.28 | 27.3,4.91 27.3,3.64 | 27.3,3.64 27.3,1.74 | 25.39,4.91 26.03,4.91 26.66,4.28 | 26.66,4.91 26.66,4.28 | 24.12,4.91 26.66,4.91 | 29.2,4.91 31.11,4.91 31.74,4.28 31.74,1.11 32.38,1.11 | 32.38,1.11 33.02,1.11 33.02,4.28 33.65,4.91 | 33.65,4.91 35.55,4.91 | 33.65,4.91 32.38,4.91 | 32.38,4.91 32.38,1.11 | 32.38,1.11 32.38,3.64 33.65,4.91 | 34.28,5.55 33.65,4.91 | 35.55,4.91 36.19,4.91 36.83,4.28 36.83,1.11 38.09,1.11 38.09,4.28 | 38.09,4.91 38.09,4.28 | 37.46,4.91 38.09,4.91 | 37.46,4.91 37.46,1.74 | 39.37,4.91 40.63,4.91 | 43.17,4.91 43.17,1.11 41.91,1.11 41.91,4.28 | 42.54,4.91 43.17,4.91 | 42.54,4.91 41.91,4.91 | 41.91,4.28 41.91,4.91 | 42.54,3.64 41.91,4.28 | 42.54,3.64 42.54,1.74 | 42.54,3.64 42.54,4.91 | 44.45,5.55 42.54,3.64 | 44.45,5.55 45.71,5.55 46.98,4.28 46.98,1.11 47.62,1.11 | 47.62,1.11 48.26,1.11 48.26,4.91
  Bottom 0.813: 47.62,4.91 48.26,4.91 | 47.62,1.11 47.62,4.91 | 47.62,1.11 47.62,3.64 48.89,4.91 | 50.8,4.91 48.89,4.91 | 52.06,2.38 52.06,1.11 52.7,1.11 | 52.06,2.38 52.06,3.64 | 52.7,1.11 53.34,1.11 53.34,4.28 53.97,4.91 | 52.06,4.91 53.97,4.91 | 52.7,3.64 52.7,4.28 | 52.7,5.55 52.7,3.64 | 52.7,3.64 52.7,1.11 | 52.7,5.55 55.24,5.55 | 57.78,1.11 57.14,1.11 57.14,4.28 | 57.78,1.11 58.41,1.11 58.41,4.91 | 57.14,4.91 58.41,4.91 | 57.14,4.91 57.78,4.28 57.78,3.64 | 57.78,3.64 57.78,1.11 | 57.14,4.28 57.78,3.64 | 57.14,4.28 58.41,4.28 59.05,4.91 | 59.05,4.91 57.78,3.64 | 60.95,4.91 59.05,4.91 | 62.86,5.55 62.86,1.11 62.23,1.11 62.23,3.64 | 62.86,5.55 62.23,4.91 | 62.23,4.91 62.23,4.28 | 38.73,4.91 38.09,4.28 | 38.73,4.91 41.27,4.91 41.91,4.28 | 27.3,3.64 28.57,4.91 | 22.86,3.64 22.86,1.11 20.31,1.11 | 19.04,1.11 19.68,1.11 | 19.04,1.11 19.04,2.38 | 19.04,3.01 19.04,3.64 19.68,4.28 20.31,4.28 | 20.31,4.28 21.59,4.28 | 19.04,3.01 20.31,4.28 | 19.04,3.01 19.04,2.38 | 19.04,2.38 19.04,1.74 19.68,1.11 | 19.68,1.11 20.31,1.11 | 20.31,1.11 21.59,1.11 22.22,1.74 22.22,3.01 | 22.22,3.01 22.22,4.28 | 22.22,4.28 21.59,4.28 | 21.59,4.28 20.95,4.28 19.04,2.38 | 19.04,2.38 19.68,1.74 | 19.68,1.74 20.31,1.11 | 19.68,1.74 19.68,2.38 21.59,4.28 | 21.59,4.28 21.59,2.38 | 21.59,2.38 21.59,1.74 20.31,1.74 20.31,2.38 20.95,3.01 | 21.59,2.38 20.95,2.38 | 22.22,4.28 23.49,4.28 24.12,4.91 | 24.12,4.91 22.22,3.01 | 52.7,3.64 52.06,4.28 | 52.7,3.64 52.7,3.01 52.06,2.38 | 52.06,4.28 52.06,2.38 | 52.06,4.28 52.06,4.91 | 52.06,4.91 50.8,4.91 | 51.43,4.91 50.8,4.91 | 52.06,4.28 51.43,4.91 | 56.51,4.91 57.14,4.28 | 62.23,4.28 62.23,3.64 | 61.59,4.91 62.23,4.28 | 62.23,3.64 60.95,4.91 | 14.6,5.55 13.96,6.18
  Bottom 0.813: 15.23,4.91 14.6,5.55 | 15.23,4.91 17.14,3.01 | 15.23,4.28 15.23,3.01 | 15.23,3.01 15.23,1.74 15.87,1.11 18.41,1.11 | 18.41,1.11 18.41,3.01 15.23,6.18 | 15.23,6.18 15.23,5.55 15.87,4.91 | 15.87,4.91 17.77,3.01 17.77,2.38 | 17.77,2.38 17.77,1.74 15.87,1.74 15.87,4.28 15.23,4.91 | 15.23,4.28 15.23,4.91 | 15.23,4.28 15.23,3.64 16.5,2.38 17.77,2.38 | 17.77,2.38 17.14,2.38 16.5,3.01 16.5,3.64 14.6,5.55 | 12.7,5.55 14.6,5.55 | 12.7,5.55 11.42,5.55 11.42,4.91 | 11.42,4.91 14.6,4.91 | 14.6,4.91 15.87,4.91 | 14.6,4.91 12.06,4.91 | 11.42,4.91 12.06,4.91 | 11.42,4.91 10.79,4.91 | 12.06,4.91 12.7,5.55 | 14.6,4.91 15.23,4.28 | 9.52,4.91 11.42,4.91 | 15.23,3.01 15.23,1.11 18.41,1.11 | 62.86,6.82 61.59,6.82 | 62.86,6.82 62.86,8.09 | 62.86,9.36 62.23,10 | 61.59,9.36 62.23,10 | 61.59,9.36 62.86,9.36 | 62.86,8.09 62.86,9.36 | R10.1 62.86,8.09
  Bottom 1.016: 60.32,22.7 60.32,23.96 | 60.32,22.7 60.32,20.79 59.69,20.79 59.69,23.96 61.59,23.96 62.23,23.96 62.23,22.7 62.23,21.43 | 60.95,20.79 61.59,21.43 | 60.95,22.06 60.95,23.33 61.59,23.33 61.59,22.06 | 60.95,22.06 60.95,21.43 | 60.32,22.7 60.95,22.06
  Bottom 1.27: BUS.13 BUS.11 | BUS.13 BUS.15 | 42.54,84.92 BUS.13 | 42.54,84.92 IC6.GND | 42.54,84.92 42.54,91.91 42.54,92.55 C7.1 | 42.54,84.92 v40,84.92 | 34.92,22.06 IC1.31 | 34.92,22.06 34.92,20.16 | 34.92,22.06 34.92,20.79 33.65,19.52 | 33.65,19.52 33.65,20.79 34.92,22.06 | 34.92,22.06 32.38,19.52 | 34.92,22.06 36.83,20.16 | 29.84,10.63 30.47,16.34 | 30.47,16.34 33.65,19.52 | 7.62,5.55 7.62,1.11 8.88,1.11 8.88,3.01 | 8.88,3.01 8.88,4.91 | 8.25,2.38 8.88,3.01 | 8.25,2.38 8.25,3.64 9.52,4.91 10.15,5.55 10.79,5.55 | 8.25,2.38 8.25,1.74 | 60.32,13.8 60.32,13.17 60.32,12.54 60.32,11.9 | 7.62,13.8 7.62,13.17 | 7.62,13.8 7.62,20.16 16.5,20.16 | 16.5,20.16 21.59,20.16 | 21.59,20.16 22.22,20.16 | 22.22,20.16 22.86,20.16 | 28.57,20.16 22.86,20.16 | 29.2,20.16 28.57,20.16 | 30.47,20.16 35.55,20.16 | 35.55,20.16 38.73,20.16 40.63,20.16 41.27,20.16 41.91,20.16 | 41.91,20.16 49.52,20.16 | 55.88,20.16 49.52,20.16 | 55.88,20.16 59.05,20.16 62.23,20.16 | 63.5,20.16 62.23,20.16 | 63.5,17.62 63.5,20.16 | 63.5,16.34 63.5,17.62 | 63.5,16.34 63.5,11.27 62.86,10.63 62.23,10 | 63.5,16.34 62.23,16.34 | 63.5,16.34 63.5,13.17 62.86,12.54 62.86,13.17 62.86,13.8 62.23,14.44 | 62.23,14.44 60.95,15.71 60.95,13.8 61.59,13.8 62.23,14.44 | 62.23,14.44 62.23,15.07 62.86,15.71 61.59,15.71 | 11.42,13.8 7.62,13.8 | 13.96,13.8 11.42,13.8 | 13.96,13.8 14.6,13.8 | 14.6,13.8 15.23,13.8 | 15.23,13.8 19.68,13.8 | 26.66,13.8 20.31,13.8 | 26.66,13.8 27.3,13.8 | 27.3,13.8 29.84,13.8 | 32.38,13.8 29.84,13.8 | 32.38,13.8 33.02,13.8 33.65,13.8 | 33.65,13.8 38.73,13.8 | 45.08,13.8 40.63,13.8 | 45.71,13.8 48.26,13.8 | 50.16,13.8 51.43,13.8 | 51.43,13.8 57.14,13.8 | 57.78,13.8 57.14,13.8 | 57.78,13.8 58.41,13.8 59.05,13.8
  Bottom 1.27: 60.32,13.8 59.05,13.8 | 60.32,13.8 60.32,15.07 | 59.05,13.8 60.32,15.07 | 13.96,13.8 13.33,13.8 12.06,15.07 12.06,16.34 13.96,18.25 13.33,18.25 12.7,17.62 14.6,17.62 | 15.87,16.34 17.77,14.44 | 11.42,13.8 11.42,18.88 12.06,19.52 10.15,19.52 | 10.15,19.52 8.25,19.52 8.25,15.07 8.88,14.44 10.15,14.44 10.15,15.71 | 10.15,19.52 10.15,15.71 | 10.15,19.52 9.52,18.88 9.52,15.71 | 10.15,15.71 8.88,15.71 9.52,15.07 10.15,15.07 12.06,16.98 12.06,18.88 | 12.06,18.88 12.7,19.52 13.33,19.52 12.7,18.88 12.06,18.88 | 12.06,18.88 13.96,18.88 14.6,19.52 14.6,17.62 | 15.23,16.98 14.6,17.62 | 15.23,18.25 15.23,19.52 | 15.23,17.62 15.23,18.25 | 15.23,16.98 15.23,17.62 | 15.87,16.34 15.23,16.98 | 15.87,15.07 15.87,16.34 | 15.87,15.07 15.87,14.44 15.23,13.8 | 15.23,13.8 15.23,14.44 15.87,15.07 | 14.6,13.8 15.87,15.07 | 15.23,18.25 15.23,18.88 16.5,20.16 | 16.5,20.16 17.77,20.16 19.04,18.88 19.04,17.62 17.77,16.34 | 17.77,16.34 17.14,15.71 15.23,17.62 | 15.87,16.34 17.77,16.34 | 17.77,16.34 17.77,15.71 18.41,15.07 | 19.68,13.8 18.41,15.07 | 20.31,13.8 19.68,13.8 | 20.31,13.8 20.95,13.8 22.22,15.07 22.22,16.34 | 22.22,16.34 21.59,16.98 | 21.59,16.98 20.95,17.62 19.68,17.62 18.41,16.34 18.41,15.07 | 21.59,20.16 21.59,18.88 | 21.59,16.98 21.59,17.62 | 21.59,16.98 22.22,16.98 | 22.22,16.98 22.86,16.34 | 21.59,17.62 22.22,16.98 | 21.59,18.88 21.59,17.62 | 21.59,18.88 21.59,19.52 22.22,20.16 | 22.22,20.16 22.22,19.52 21.59,18.88 | 21.59,18.88 22.86,20.16 | 22.86,20.16 24.12,20.16 25.39,18.88 25.39,17.62 24.12,16.34 | 22.86,16.34 24.12,16.34 | 22.86,16.34 22.86,14.44 | 22.22,16.34 19.68,18.88 | 19.68,18.88 20.31,19.52 20.95,18.88 19.68,18.88
  Bottom 1.27: 19.68,18.88 19.04,19.52 | 26.66,13.8 26.03,13.8 24.12,15.71 24.12,15.07 23.49,14.44 24.76,14.44 24.76,16.34 | 27.3,13.8 28.57,15.07 28.57,16.34 27.3,17.62 26.03,17.62 25.39,16.98 | 24.76,16.34 24.12,16.34 | 24.76,16.34 25.39,16.98 | 25.39,16.98 24.76,16.98 23.49,15.71 | 28.57,20.16 28.57,19.52 27.93,18.88 | 27.93,18.88 27.93,17.62 29.2,16.34 30.47,16.34 | 30.47,16.34 31.74,17.62 31.74,18.88 30.47,20.16 | 30.47,20.16 29.2,20.16 | 27.93,18.88 29.2,20.16 | 32.38,13.8 31.11,15.07 31.11,16.34 32.38,17.62 33.65,17.62 34.92,16.34 | 34.92,16.34 35.55,15.71 | 34.92,15.07 34.92,16.34 | 34.92,15.07 34.92,14.44 34.28,14.44 33.65,13.8 | 33.65,13.8 34.92,15.07 | 34.92,15.07 36.19,16.34 35.55,16.34 34.28,17.62 | 34.28,17.62 33.65,18.25 | 34.28,18.88 34.28,17.62 | 34.28,18.88 34.28,19.52 34.92,19.52 35.55,20.16 | 35.55,20.16 34.28,18.88 | 35.55,20.16 36.83,20.16 | 36.83,20.16 38.09,18.88 38.09,17.62 | 38.09,17.62 36.19,15.71 36.19,14.44 38.09,14.44 | 38.09,14.44 37.46,15.07 | 37.46,15.07 36.83,15.71 | 38.73,13.8 38.09,14.44 | 38.73,13.8 40,13.8 | 40,13.8 40.63,13.8 | 40.63,13.8 40.63,14.44 | 40.63,14.44 41.27,15.07 | 41.27,15.07 41.91,15.71 41.27,15.71 41.27,15.07 | 40,13.8 40.63,14.44 | 41.27,15.07 41.27,16.34 40,17.62 38.73,17.62 | 38.09,17.62 38.73,17.62 | 38.09,17.62 38.09,16.98 37.46,16.34 | 37.46,16.34 37.46,15.71 | 37.46,16.34 38.73,17.62 | 37.46,15.07 37.46,16.34 | 37.46,15.07 37.46,16.98 38.73,18.25 38.73,19.52 41.27,19.52 40.63,18.88 | 40.63,18.88 40,18.25 40.63,17.62 | 40.63,17.62 40.63,18.88 | 40.63,18.88 39.37,18.88 | 40.63,18.88 41.91,20.16 | 41.91,20.16 43.17,20.16 44.45,18.88 44.45,17.62 43.17,16.34 41.91,16.34
  Bottom 1.27: 41.91,16.34 40.63,17.62 | 43.81,16.34 41.91,16.34 | 43.81,15.07 44.45,14.44 41.27,14.44 42.54,15.71 43.17,15.07 | 29.84,13.8 29.84,15.07 30.47,15.07 | 30.47,15.07 30.47,14.44 | 30.47,15.07 29.84,15.71 29.2,15.71 29.2,14.44 | 43.81,15.07 43.81,16.34 | 45.08,13.8 43.81,15.07 | 45.71,13.8 45.08,13.8 | 45.71,13.8 46.35,13.8 47.62,15.07 47.62,16.34 | 47.62,16.34 46.35,17.62 | 46.35,17.62 45.08,17.62 43.81,16.34 | 47.62,16.34 48.26,16.34 | 48.26,16.34 50.16,16.34 | 50.16,15.07 50.16,16.34 | 50.16,13.8 50.16,15.07 | 48.26,13.8 50.16,13.8 | 48.26,13.8 48.26,15.07 48.89,15.71 48.89,15.07 49.52,15.07 49.52,14.44 47.62,14.44 47.62,16.98 | 47.62,16.98 46.98,17.62 | 46.98,17.62 46.35,18.25 | 48.26,16.34 47.62,16.98 | 48.26,16.34 49.52,16.34 50.8,17.62 | 50.8,17.62 50.8,18.88 | 50.8,18.88 50.8,19.52 50.16,19.52 50.8,18.88 | 50.8,18.88 49.52,20.16 | 49.52,20.16 48.26,20.16 46.98,18.88 46.98,17.62 | 46.35,17.62 46.98,17.62 | 46.35,17.62 45.08,18.88 45.71,19.52 46.35,19.52 46.35,18.88 45.71,18.88 45.08,19.52 | 51.43,13.8 50.16,15.07 | 51.43,13.8 52.7,13.8 53.97,15.07 | 53.97,15.07 53.97,16.34 | 51.43,17.62 52.7,17.62 | 51.43,17.62 50.8,17.62 | 50.8,17.62 50.8,16.98 50.16,16.34 | 50.16,16.34 51.43,17.62 | 57.14,13.8 57.14,14.44 | 57.14,14.44 56.51,15.07 | 56.51,15.07 55.88,15.71 55.24,15.71 54.6,15.07 | 55.88,14.44 55.24,14.44 54.6,15.07 | 53.97,15.07 54.6,15.07 | 53.97,15.07 53.97,14.44 57.14,14.44 | 57.78,13.8 57.14,14.44 | 54.6,16.34 55.88,16.34 56.51,16.98 | 56.51,16.98 57.14,17.62 57.14,18.88 55.88,20.16 | 55.88,20.16 54.6,20.16 52.7,18.25 53.34,17.62 | 53.34,17.62 53.34,19.52 | 54.6,16.34 53.34,17.62 | 53.97,16.34 54.6,16.34 | 52.7,17.62 53.97,16.34
  Bottom 1.27: 52.7,17.62 52.7,19.52 51.43,18.25 | 56.51,15.07 56.51,16.34 | 56.51,16.34 56.51,16.98 | 56.51,16.98 57.14,16.98 | 57.14,16.98 57.78,17.62 59.05,17.62 | 56.51,16.34 57.14,16.98 | 60.32,15.07 60.32,16.34 | 60.32,15.07 60.95,15.07 62.23,16.34 | 60.32,16.34 60.95,16.34 | 60.32,16.34 59.05,17.62 | 59.05,17.62 59.69,18.25 | 59.69,18.25 59.69,17.62 60.95,16.34 | 62.23,16.34 60.95,16.34 | 63.5,17.62 62.23,16.34 | 63.5,17.62 63.5,18.88 62.23,20.16 | 62.23,20.16 60.95,20.16 59.69,18.88 59.05,18.88 | 58.41,18.88 57.78,18.88 | 58.41,18.88 59.05,18.88 | 59.05,18.88 59.69,19.52 59.69,18.25 | 59.69,18.25 59.05,18.25 58.41,18.88 | 58.41,18.88 58.41,19.52 57.78,19.52 | 63.5,20.16 63.5,23.96
RST
  Top 0.305: 38.73,55.72 38.73,60.8
  Top 0.61: IC1.9 37.46,39.84 36.19,41.11 33.02,41.11 31.74,42.38 31.74,50.64 33.65,52.54 37.46,52.54 38.73,53.81 38.73,55.72 | 38.73,60.8 38.73,61.43 36.83,63.34 34.28,63.34 33.02,64.61 33.02,70.32 31.11,72.22 R7.2
  Bottom 0.61: R8.1 R7.2 33.02,77.31 34.28,78.58 D1.A 35.55,81.11 Q3.3
RX  (via drill 0.61)
  Top 0.61: IC4.13 24.12,103.98 25.39,105.25 v31.74,105.25
  Bottom 0.61: RS232.2 49.73,96.99 46.98,96.99 45.71,95.72 37.46,95.72 36.19,96.99 36.19,104.61 35.55,105.25 v31.74,105.25
SCK
  Top 0.61: ISP.7 10.15,88.1 8.88,89.37 6.98,89.37 5.71,88.1 5.71,82.39 8.88,79.21 8.88,69.05 7.62,67.78 IC3.5
TX  (via drill 0.61)
  Top 0.61: IC4.7 31.74,96.99 32.38,97.62 v41.27,97.62
  Bottom 0.61: RS232.3 49.52,99.53 46.35,99.53 44.45,97.62 v41.27,97.62
(copper drawn outside any net)
  shapes: Bottom area x1

### Text on the board
tPlace: TUR com Mãe - Vs 1.02 - 09/2007